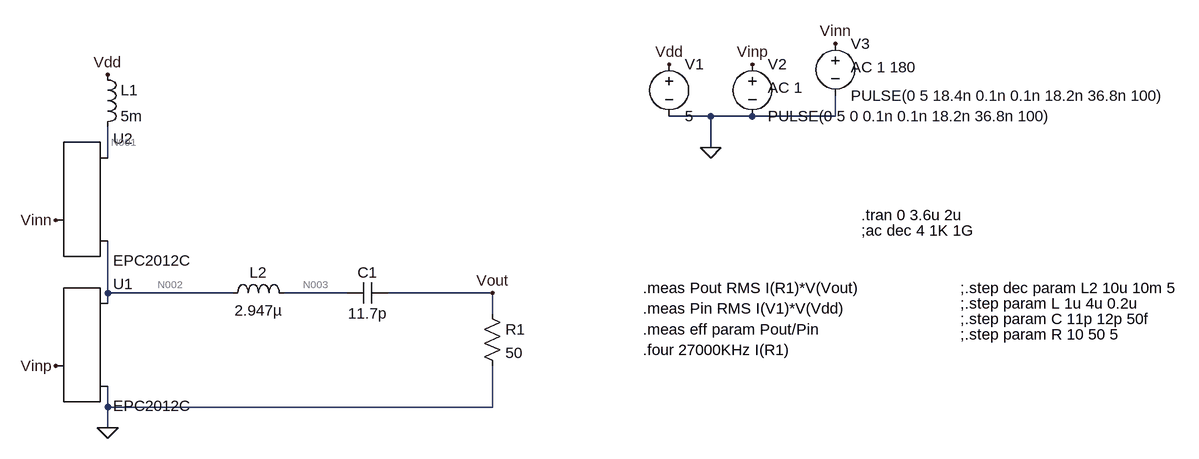
[diagram p0: schematic ClassD_VoltageSwitching.asc]
ClassD_VoltageSwitching.asc, the LTspice schematic file:
Version 4
SHEET 1 1364 680
WIRE 480 -128 416 -128
WIRE 544 -128 480 -128
WIRE 672 -128 672 -160
WIRE 672 -128 544 -128
WIRE 480 -80 480 -128
WIRE -448 -64 -448 -112
WIRE -448 144 -448 64
WIRE -256 144 -448 144
WIRE -80 144 -176 144
WIRE 144 144 -16 144
WIRE -448 160 -448 144
WIRE 144 176 144 144
WIRE -448 320 -448 288
WIRE 144 320 144 256
WIRE 144 320 -448 320
WIRE -448 352 -448 320
FLAG -448 352 0
FLAG -448 -192 Vdd
FLAG -528 256 Vinp
FLAG -528 32 Vinn
FLAG 480 -80 0
FLAG 416 -208 Vdd
FLAG 544 -208 Vinp
FLAG 672 -240 Vinn
FLAG 144 144 Vout
SYMBOL EPCGaN -528 256 R0
SYMATTR InstName U1
SYMATTR Value EPC2012C
SYMBOL EPCGaN -528 32 R0
SYMATTR InstName U2
SYMATTR Value EPC2012C
SYMBOL ind -464 -208 R0
SYMATTR InstName L1
SYMATTR Value 5m
SYMBOL ind -272 160 R270
WINDOW 0 32 56 VTop 2
WINDOW 3 5 56 VBottom 2
SYMATTR InstName L2
SYMATTR Value 2.947µ
SYMATTR SpiceLine Rser=0.1
SYMBOL cap -16 128 R90
WINDOW 0 0 32 VBottom 2
WINDOW 3 32 32 VTop 2
SYMATTR InstName C1
SYMATTR Value 11.7p
SYMATTR SpiceLine Rser=0.1
SYMBOL res 128 160 R0
SYMATTR InstName R1
SYMATTR Value 50
SYMBOL voltage 416 -224 R0
WINDOW 123 0 0 Left 0
WINDOW 39 0 0 Left 0
SYMATTR InstName V1
SYMATTR Value 5
SYMBOL voltage 544 -224 R0
WINDOW 123 24 52 Left 2
WINDOW 39 0 0 Left 0
SYMATTR Value2 AC 1
SYMATTR InstName V2
SYMATTR Value PULSE(0 5 0 0.1n 0.1n 18.2n 36.8n 100)
SYMBOL voltage 672 -256 R0
WINDOW 123 24 52 Left 2
WINDOW 39 0 0 Left 0
SYMATTR Value2 AC 1 180
SYMATTR InstName V3
SYMATTR Value PULSE(0 5 18.4n 0.1n 0.1n 18.2n 36.8n 100)
TEXT 712 24 Left 2 !.tran 0 3.6u 2u
TEXT 712 48 Left 2 !;ac dec 4 1K 1G
TEXT 864 160 Left 2 !;.step param L 1u 4u 0.2u
TEXT 376 136 Left 2 !.meas Pout RMS I(R1)*V(Vout)
TEXT 376 168 Left 2 !.meas Pin RMS I(V1)*V(Vdd)
TEXT 376 200 Left 2 !.meas eff param Pout/Pin
TEXT 376 232 Left 2 !.four 27000KHz I(R1)
TEXT 864 208 Left 2 !;.step param R 10 50 5
TEXT 864 136 Left 2 !;.step dec param L2 10u 10m 5
TEXT 864 184 Left 2 !;.step param C 11p 12p 50f

The netlist it stands for:
* ClassD_VoltageSwitching.asc
XU1 Vinp N002 0 EPC2012C
XU2 Vinn N001 N002 EPC2012C
L1 Vdd N001 5m
L2 N002 N003 2.947µ Rser=0.1
C1 Vout N003 11.7p Rser=0.1
R1 Vout 0 50
V1 Vdd 0 5
V2 Vinp 0 PULSE(0 5 0 0.1n 0.1n 18.2n 36.8n 100) AC 1
V3 Vinn 0 PULSE(0 5 18.4n 0.1n 0.1n 18.2n 36.8n 100) AC 1 180
.tran 0 3.6u 2u
;ac dec 4 1K 1G
;.step param L 1u 4u 0.2u
.meas Pout RMS I(R1)*V(Vout)
.meas Pin RMS I(V1)*V(Vdd)
.meas eff param Pout/Pin
.four 27000KHz I(R1)
;.step param R 10 50 5
;.step dec param L2 10u 10m 5
;.step param C 11p 12p 50f
.backanno
.end

* Results of the author's LTspice run, read from the files saved beside the schematic
* Operating Point, zero values left out:
*   V(n002) = 192.6 mV
*   V(n001) = 5 V
*   V(vdd) = 5 V
*   V(n003) = 192.6 mV
*   I(L1) = 624.3 nA
*   I(V3) = 42.91 nA
*   I(V2) = 6.518 nA
*   I(V1) = -624.3 nA
*   Ix(u1:GATEIN) = -6.518 nA
*   Ix(u1:DRAININ) = 581.4 nA
*   Ix(u1:SOURCEIN) = -574.9 nA
*   Ix(u2:GATEIN) = -42.91 nA
*   Ix(u2:DRAININ) = 624.3 nA
*   Ix(u2:SOURCEIN) = -581.4 nA
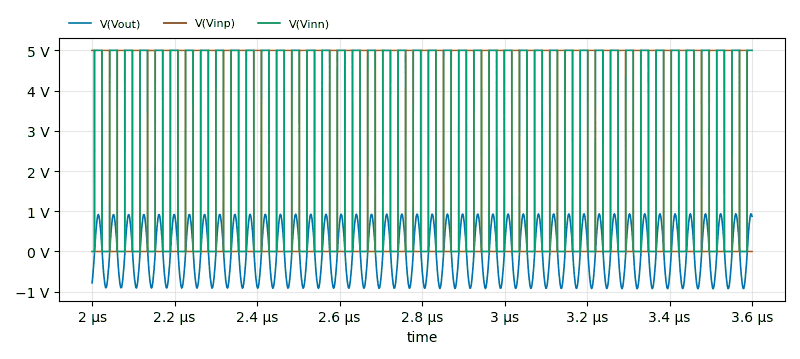
[diagram p1: Transient Analysis of ClassD_VoltageSwitching.asc, plotted from the saved traces]
* Transient Analysis, 1 run:
*   V(Vout): min -927.9 mV, max 938.2 mV, average 2.965 mV, rms 650.3 mV, last 874.1 mV
*   V(Vinp): min 0 V, max 5 V, average 2.476 V, rms 3.516 V, last 0 V
*   V(Vinn): min 0 V, max 5 V, average 2.496 V, rms 3.53 V, last 5 V
* From the log:
*   N-Period=1
*   Fourier components of I(r1)
*   DC component:0.00011324
*   Harmonic  Frequency   Fourier   Normalized   Phase    Normalized
*    Number     [Hz]     Component   Component  [degree]  Phase [deg]
*       1     2.700e+07  1.856e-02  1.000e+00     39.45°      0.00°
*       2     5.400e+07  4.670e-05  2.516e-03     -8.15°    -47.60°
*       3     8.100e+07  1.641e-04  8.842e-03     76.03°     36.58°
*       4     1.080e+08  4.045e-05  2.179e-03     40.68°      1.22°
*       5     1.350e+08  1.908e-04  1.028e-02    175.80°    136.35°
*       6     1.620e+08  5.601e-06  3.017e-04    -43.97°    -83.43°
*       7     1.890e+08  5.324e-05  2.868e-03   -117.74°   -157.19°
*       8     2.160e+08  1.769e-05  9.529e-04    -69.34°   -108.80°
*       9     2.430e+08  2.081e-05  1.121e-03   -157.26°   -196.71°
*   Total Harmonic Distortion: 1.433027%(1.499387%)
*   pout: RMS(i(r1)*v(vout))=0.0102315 FROM 0 TO 1.6e-006
*   pin: RMS(i(v1)*v(vdd))=0.0123774 FROM 0 TO 1.6e-006
*   eff: pout/pin=0.826622